# EAGLE design lcd_duffle_smd_mk_3 (EAGLE 6.5.0)
LCD Dufflebag Ride-along I2C interface for a standard LCD screen, including RGB support. Uses an ATTiny84 plus WS2811 (for backlight control). This is the PTH version
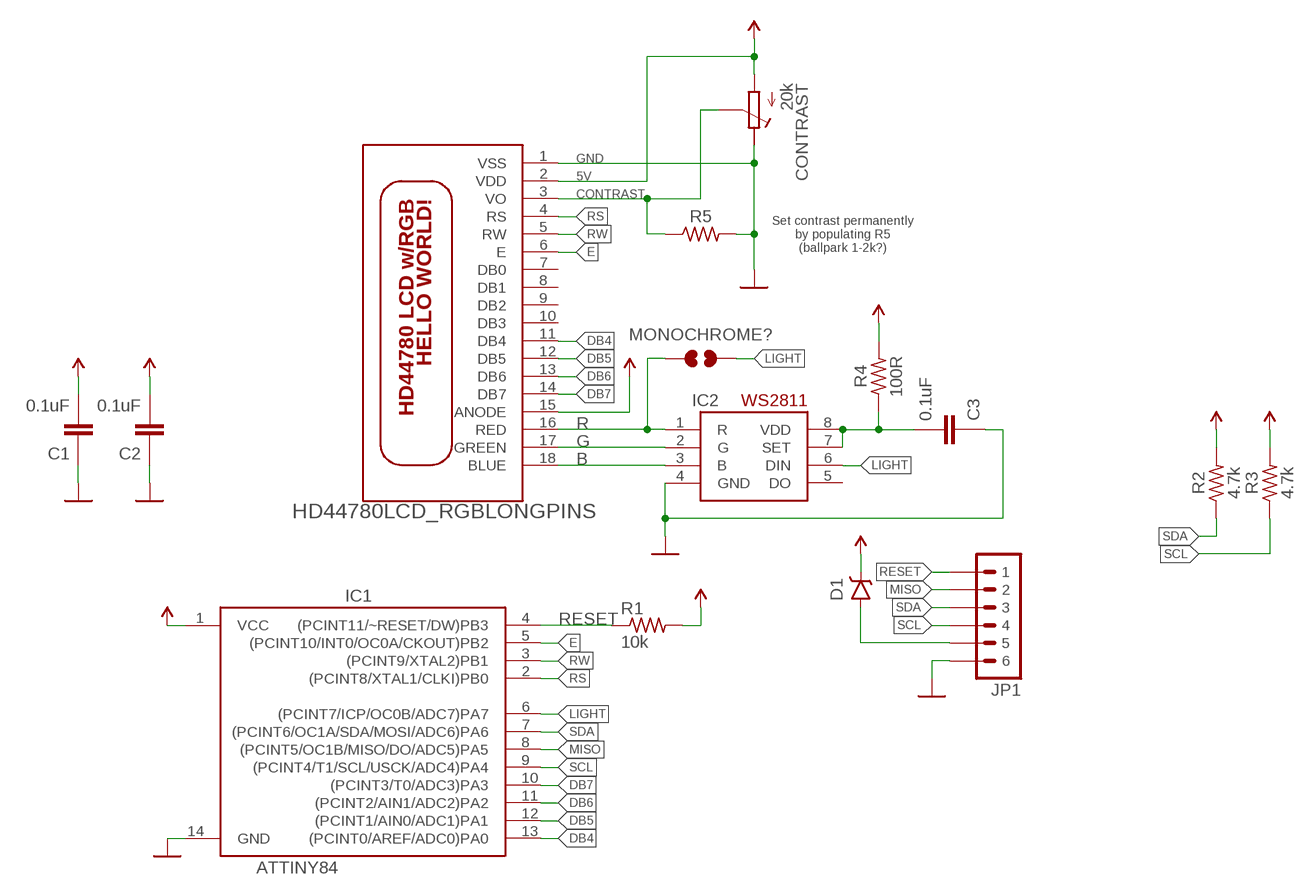
[diagram p0: schematic, sheet 1]

## Parts
C1  0.1uF  CAPACITOR-CERAMICC0805  [C0805]
C2  0.1uF  CAPACITOR-CERAMICC0805  [C0805]
C3  0.1uF  CAPACITOR-CERAMICC0805  [C0805]
CONTRAST  20k  POTENTIOMETER3314Z  [RTRIM3314Z-SIDE]
D1  MBRA140  DIODE-SCHOTTKYMBRA140  [SMA-DIODE]
IC1  ATTINY84  [SO14]
IC2  WS2811  WS2811-SOP8  [SO08-SKINNYPADS]
JP1  M06SMD  [1X06-SMD]
MONOCHROME?  JUMPER-PAD-2-NOYES_SILK  [PAD-JUMPER-2-NO_YES_SILK]
R1  10k  RESISTORR0805  [R0805]
R2  4.7k  RESISTORR0805  [R0805]
R3  4.7k  RESISTORR0805  [R0805]
R4  100R  RESISTORR0805  [R0805]
R5  RESISTORR0805  [R0805]
U$1  HD44780LCD_RGBLONGPINS  [LCD1602-RGB-CENTERED]

## Nets
5V: C1.2 C2.2 CONTRAST.1(A) D1.C IC1.1(VCC) R1.2 R2.2 R3.2 R4.2 U$1.2(VDD) U$1.15(ANODE)
B: IC2.3(B) U$1.18(BLUE)
CONTRAST: CONTRAST.2(S) R5.1 U$1.3(VO)
DB4: IC1.13((PCINT0/AREF/ADC0)PA0) U$1.11(DB4)
DB5: IC1.12((PCINT1/AIN0/ADC1)PA1) U$1.12(DB5)
DB6: IC1.11((PCINT2/AIN1/ADC2)PA2) U$1.13(DB6)
DB7: IC1.10((PCINT3/T0/ADC3)PA3) U$1.14(DB7)
E: IC1.5((PCINT10/INT0/OC0A/CKOUT)PB2) U$1.6(E)
G: IC2.2(G) U$1.17(GREEN)
GND: C1.1 C2.1 C3.1 CONTRAST.3(E) IC1.14(GND) IC2.4(GND) JP1.6 R5.2 U$1.1(VSS)
LIGHT: IC1.6((PCINT7/ICP/OC0B/ADC7)PA7) IC2.6(DIN) MONOCHROME?.2
MISO: IC1.8((PCINT5/OC1B/MISO/DO/ADC5)PA5) JP1.2
N$1: D1.A JP1.5
N$2: C3.2 IC2.7(SET) IC2.8(VDD) R4.1
R: IC2.1(R) MONOCHROME?.1 U$1.16(RED)
RESET: IC1.4((PCINT11/~RESET/DW)PB3) JP1.1 R1.1
RS: IC1.2((PCINT8/XTAL1/CLKI)PB0) U$1.4(RS)
RW: IC1.3((PCINT9/XTAL2)PB1) U$1.5(RW)
SCL: IC1.9((PCINT4/T1/SCL/USCK/ADC4)PA4) JP1.4 R3.1
SDA: IC1.7((PCINT6/OC1A/SDA/MOSI/ADC6)PA6) JP1.3 R2.1
Unconnected: IC2.5(DO) U$1.7(DB0) U$1.8(DB1) U$1.9(DB2) U$1.10(DB3)

## Notes on the sheet
- Set contrast permanently
  by populating R5
  (ballpark 1-2k?)

## Library data of the parts
C1-C3 = A_butts:CAPACITOR-CERAMIC: CAPACITOR, European symbol
CONTRAST = A_butts:POTENTIOMETER: Trimm resistor
D1 = A_butts:DIODE-SCHOTTKY: Schottky diodes in SFE's production catalog BAT20J 1A 23V 0.62Vf RB751 120mA 40V 0.37Vf PMEG4005EJ 0.5A 40V 0.42Vf MBRA140 1A 40V 0.5Vf B340A 3A 40V SMA; PROD_ID: DIO-08053
IC1 = A_butts:ATTINY84: Atmel 14-pin 2/4/8kB flash uC
IC2 = A_butts:WS2811
JP1 = A_butts:M06: Header 6 Standard 6-pin 0.1" header. Use with straight break away headers (SKU : PRT-00116), right angle break away headers (PRT-00553), swiss pins (PRT-00743), machine pins (PRT-00117), and female headers (PRT-00115). Molex polarized connector foot print use with SKU : PRT-08094 with associated crimp pins and housings. NOTES ON THE VARIANTS LOCK and LOCK_LONGPADS... This footprint was designed to help hold the alignment of a through-hole component (i.e. 6-pin header) while soldering it into place. You may notice that each hole has been shifted either up or down by 0.005 of an inch from it's more standard position (which is a perfectly straight line). This slight alteration caused the pins (the squares in the middle) to touch the edges of the holes. Because they are alternating, it causes a "brace" to hold the component in place. 0.005 has proven to be the perfect amount of "off-center" position when using our standard breakaway headers. Although looks a little odd when you look at the bare footprint, once you have a header in there, the alteration is very hard to notice. Also,if you push a header all the way into place, it is covered up entirely on the bottom side. This idea of altering the position of holes to aid alignment will be further integrated into the Sparkfun Library for other footprints. It can help hold any component with 3 or more connection pins.
MONOCHROME? = A_butts:JUMPER-PAD-2-NO
R1-R5 = A_butts:RESISTOR: RESISTOR, American symbol
U$1 = A_butts:HD44780LCD_RGB

## Board
LCD Dufflebag SMD Mark III Controls a "stanard" LCD over I2C. Designed to be attached to the back of the LCD, either monochrome or RGB, component side facing the back of the LCD. This leaves the back almost entirely bare, so less worry about shorts and whatnot when mounting. (I should make a version that uses SMT connectors to the LCD.) Attiny84-based, with AVR ISP broken out as a non-standard 6-pin connector. The layout was choosen to take advantage of the fact that SPI and I2C use the same pins on Attiny84's, meaning only one connector is needed for both programming and field use. For more schematics, non-working firmware, and potentially help, see the github repo.
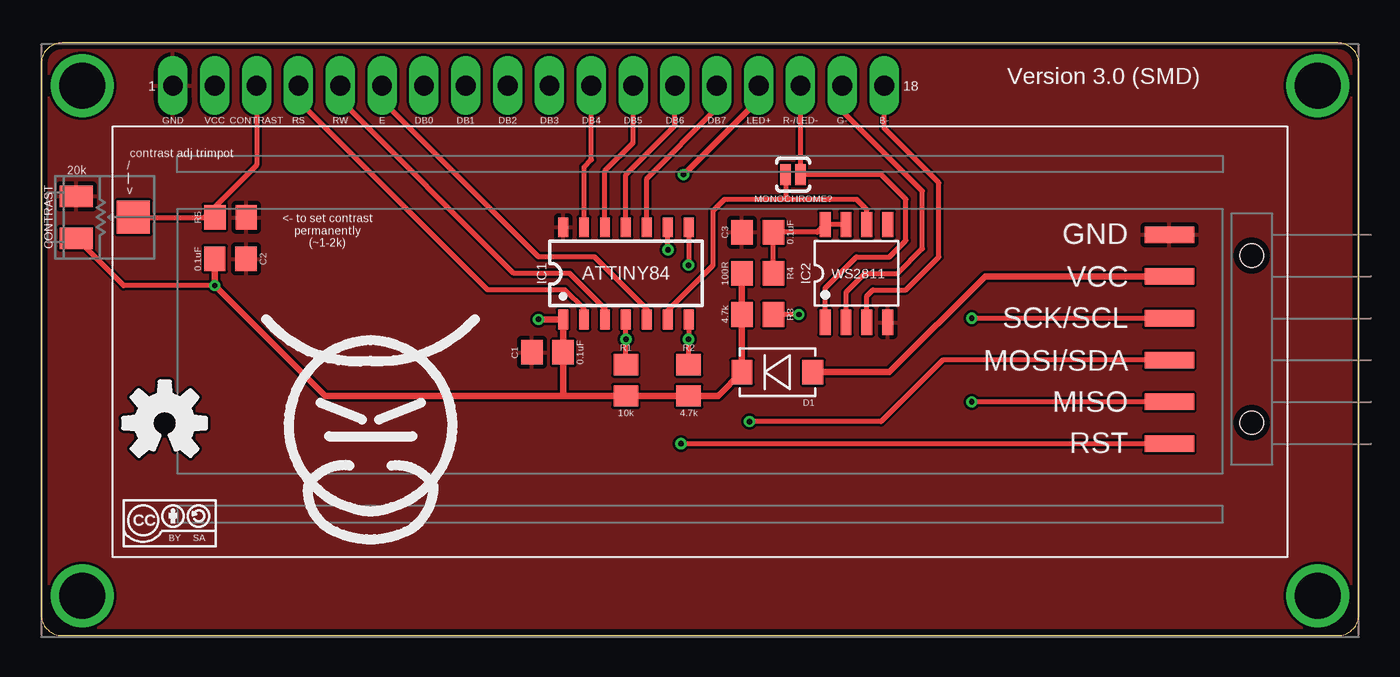
[diagram p1: board, top side]
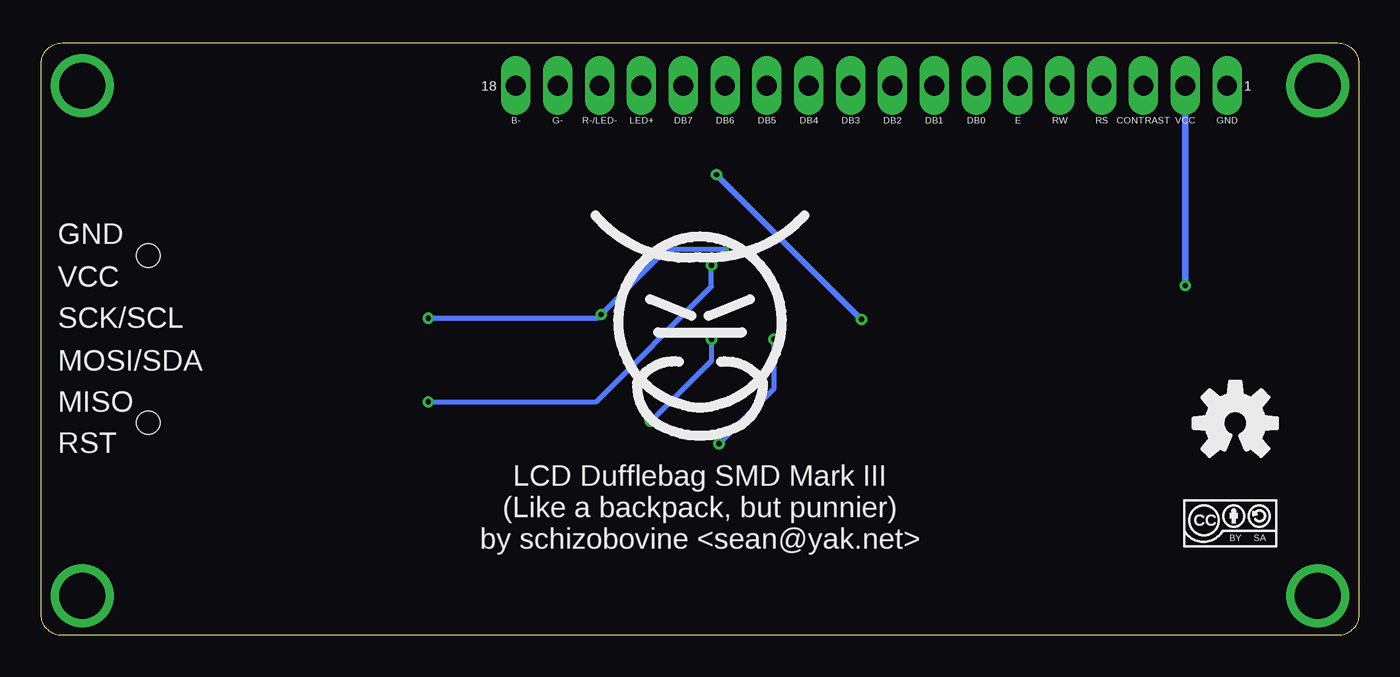
[diagram p2: board, bottom side, seen from below]

Size 80 x 36 mm. Coordinates in mm from the lower left corner, seen from the top.
Outline: 0,34.73 0,1.27 arc90 1.27,0 78.73,0 arc90 80,1.27 80,34.73 arc90 78.73,36 1.27,36 arc90 0,34.73
Copper layers (1*16): Top 0.0356mm / dielectric 1.5011mm / Bottom 0.0356mm
Design rules "LaenPCBOrder2": minimum track width 6mil, minimum drill 13mil, track to track 6mil, track to pad 6mil, pad to pad 6mil, via to via 6mil, smd to smd 6mil, copper to edge 15mil, drill to drill 6mil, minimum pad ring 7mil, minimum via ring 7mil, stop-mask expansion 3mil, vias tented up to drill 20mil, thermal gap 10mil

### Footprints (pad centres in the part's own frame; a part is rotated, then mirrored left to right if it is on the bottom)
C0805 = smd 1.3 x 1.5: 1 -0.95,0; 2 0.95,0
RTRIM3314Z-SIDE = smd 1.3 x 2.01: 1 -1.27,1.74; 3 1.27,1.74 | smd 2.01 x 2.01: 2 0,-1.74
SMA-DIODE = smd 1.27 x 1.47: A -2.15,0; C 2.15,0
SO14 = smd 0.6 x 1.2: 1 -3.81,-2.8; 2 -2.54,-2.8; 3 -1.27,-2.8; 4 0,-2.8; 5 1.27,-2.8; 6 2.54,-2.8; 7 3.81,-2.8; 8 3.81,2.8; 9 2.54,2.8; 10 1.27,2.8; 11 0,2.8; 12 -1.27,2.8; 13 -2.54,2.8; 14 -3.81,2.8
SO08-SKINNYPADS = smd 0.66 x 1.524: 1 -1.905,-2.973; 2 -0.635,-2.973; 3 0.635,-2.973; 4 1.905,-2.973; 5 1.905,2.973; 6 0.635,2.973; 7 -0.635,2.973; 8 -1.905,2.973
1X06-SMD = smd 1 x 3: 1 -6.35,5; 2 -3.81,5; 3 -1.27,5; 4 1.27,5; 5 3.81,5; 6 6.35,5 | hole 1.4: -5.08,0; 5.08,0
PAD-JUMPER-2-NO_YES_SILK = smd 0.635 x 1.27: 1 -0.45,0; 2 0.45,0
R0805 = smd 1.3 x 1.5: 1 -0.95,0; 2 0.95,0
LCD1602-RGB-CENTERED = drill 1.2 pad 1.778 long: 1 -32,15.5; 2 -29.46,15.5; 3 -26.92,15.5; 4 -24.38,15.5; 5 -21.84,15.5; 6 -19.3,15.5; 7 -16.76,15.5; 8 -14.22,15.5; 9 -11.68,15.5; 10 -9.14,15.5; 11 -6.6,15.5; 12 -4.06,15.5; 13 -1.52,15.5; 14 1.02,15.5; 15 3.56,15.5; 16 6.1,15.5; 17 8.64,15.5; 18 11.18,15.5 | drill 2.8 pad 3.81: HOLE1 -37.5,15.5; HOLE2 37.5,15.5; HOLE3 -37.5,-15.5; HOLE4 37.5,-15.5

### Placement (x,y rotation side)
C1  30.74,17.2 0 top
C2  11.49,22.88 180 top
C3  43.5,24.5 0 top
CONTRAST  3.86,25.41 90 top
D1  44.7,16 180 top
IC1  35.5,22 0 top
IC2  49.5,22 0 top
JP1  73.5,18 90 top
MONOCHROME?  45.65,28 180 top
R1  35.5,15.5 270 top
R2  39.31,15.5 270 top
R3  43.5,19.5 180 top
R4  43.5,22 180 top
R5  11.5,25.4 0 top
U$1  40,17.91 0 top
U$2  [COW]  20,11.6 0 top
U$3  [COW]  40,17.9 0 bottom
U$4  [CC-BY-SA-4.0-NO-URL]  7.8,6.8 0 top
U$5  [CC-BY-SA-4.0-NO-URL]  7.8,6.8 0 bottom
U$6  [OSHWLOGO_TOP_0.2_A]  7.5,12.9 0 top
U$7  [OSHWLOGO_BOT_0.2_A]  7.5,12.9 0 top

### Tracks (layer width: path | path; a pad name or v marks a point on that pad's centre or on a via)
5V  (via drill 0.33)
  Top 0.305: IC1.1 31.65,19.2 | v10.54,21.26 5,21.26 CONTRAST.1
  Top 0.406: R4.2 R3.2 D1.C 41.1,14.55 R2.2 R1.2 31.69,14.55 | U$1.15 43.56,32.56 v39,28 | 31.69,14.55 C1.2 IC1.1 | 31.65,19.2 v30.2,19.2 | 31.69,14.55 17.25,14.55 v10.54,21.26 C2.2
  Bottom 0.406: v39,28 v30.2,19.2 | U$1.2 v10.54,21.26
B
  Top 0.305: IC2.3 50.13,20.64 50.5,21 52.5,21 54.5,23 54.5,27.5 51.18,30.82 U$1.18
CONTRAST
  Top 0.305: CONTRAST.2 9.9,25.4 | 9.9,25.4 R5.1 | U$1.3 13.08,28.58 9.9,25.4
DB4
  Top 0.305: IC1.13 32.96,28.46 33.4,28.9 U$1.11
DB5
  Top 0.305: IC1.12 34.23,28.23 35.94,29.94 U$1.12
DB6
  Top 0.305: IC1.11 35.5,28 38.48,30.98 U$1.13
DB7
  Top 0.305: IC1.10 36.77,27.77 41,32 41,33.39 U$1.14
E
  Top 0.305: IC1.5 36.77,19.83 33.6,23 30.2,23 20.7,32.5 U$1.6
G
  Top 0.305: IC2.2 48.87,20.86 50,22 52,22 53.5,23.5 53.5,27 48.64,31.86 U$1.17
GND
  pour Top: 80,34.73 80,1.27 arc-90 78.73,0 1.27,0 arc-90 0,1.27 0,34.73 arc-90 1.27,36 78.73,36 arc-90
LIGHT
  Top 0.305: IC1.6 38.04,19.74 40.8,22.5 40.8,25.8 41.5,26.5 45.2,26.5 | IC2.6 50.13,25.86 49.5,26.5 45.2,26.5 | MONOCHROME?.2 45.2,26.5
MISO  (via drill 0.33)
  Top 0.305: JP1.2 v56.5,14.19 | IC1.8 v39.31,22.5
  Bottom 0.305: v56.5,14.19 46.31,14.19 39.31,21.19 v39.31,22.5
N$1
  Top 0.406: JP1.5 57.31,21.81 51.5,16 D1.A
N$2
  Top 0.305: IC2.7 IC2.8 47.12,24.5 C3.2 R4.1
R
  Top 0.305: IC2.1 47.59,21.09 49.5,23 51.5,23 52.5,24 52.5,26.5 51,28 MONOCHROME?.1 U$1.16
RESET  (via drill 0.33)
  Top 0.305: JP1.1 v38.85,11.65 | IC1.4 v35.5,18 R1.1
  Bottom 0.305: v38.85,11.65 35.5,15 v35.5,18
RS
  Top 0.305: IC1.2 32.96,19.84 31.8,21 27.1,21 15.6,32.5 15.62,32.52 U$1.4
RW
  Top 0.305: IC1.3 34.23,19.87 32.1,22 28.7,22 18.16,32.54 U$1.5
SCL  (via drill 0.33)
  Top 0.305: JP1.4 v56.5,19.27 | v46,19.5 R3.1 | v38.05,23.44 v38.04,23.45 IC1.9
  Bottom 0.305: v38.05,23.44 42.06,23.44 v46,19.5 46.23,19.27 v56.5,19.27
SDA  (via drill 0.33)
  Top 0.305: JP1.3 54.73,16.73 51,13 v43,13 | IC1.7 v39.31,18 R2.1
  Bottom 0.305: v39.31,18 39.31,16.69 v43,13

### Text on the board
tPlace: Version 3.0 (SMD) | contrast adj trimpot / / / | / v | <- to set contrast / permanently / (~1-2k) | GND | VCC | SCK/SCL | MOSI/SDA | MISO | RST
bPlace: GND | VCC | SCK/SCL | MOSI/SDA | MISO | RST | LCD Dufflebag SMD Mark III / (Like a backpack, but punnier) / by schizobovine <sean@yak.net>